# Altium project XL4005_5A.PrjPcb
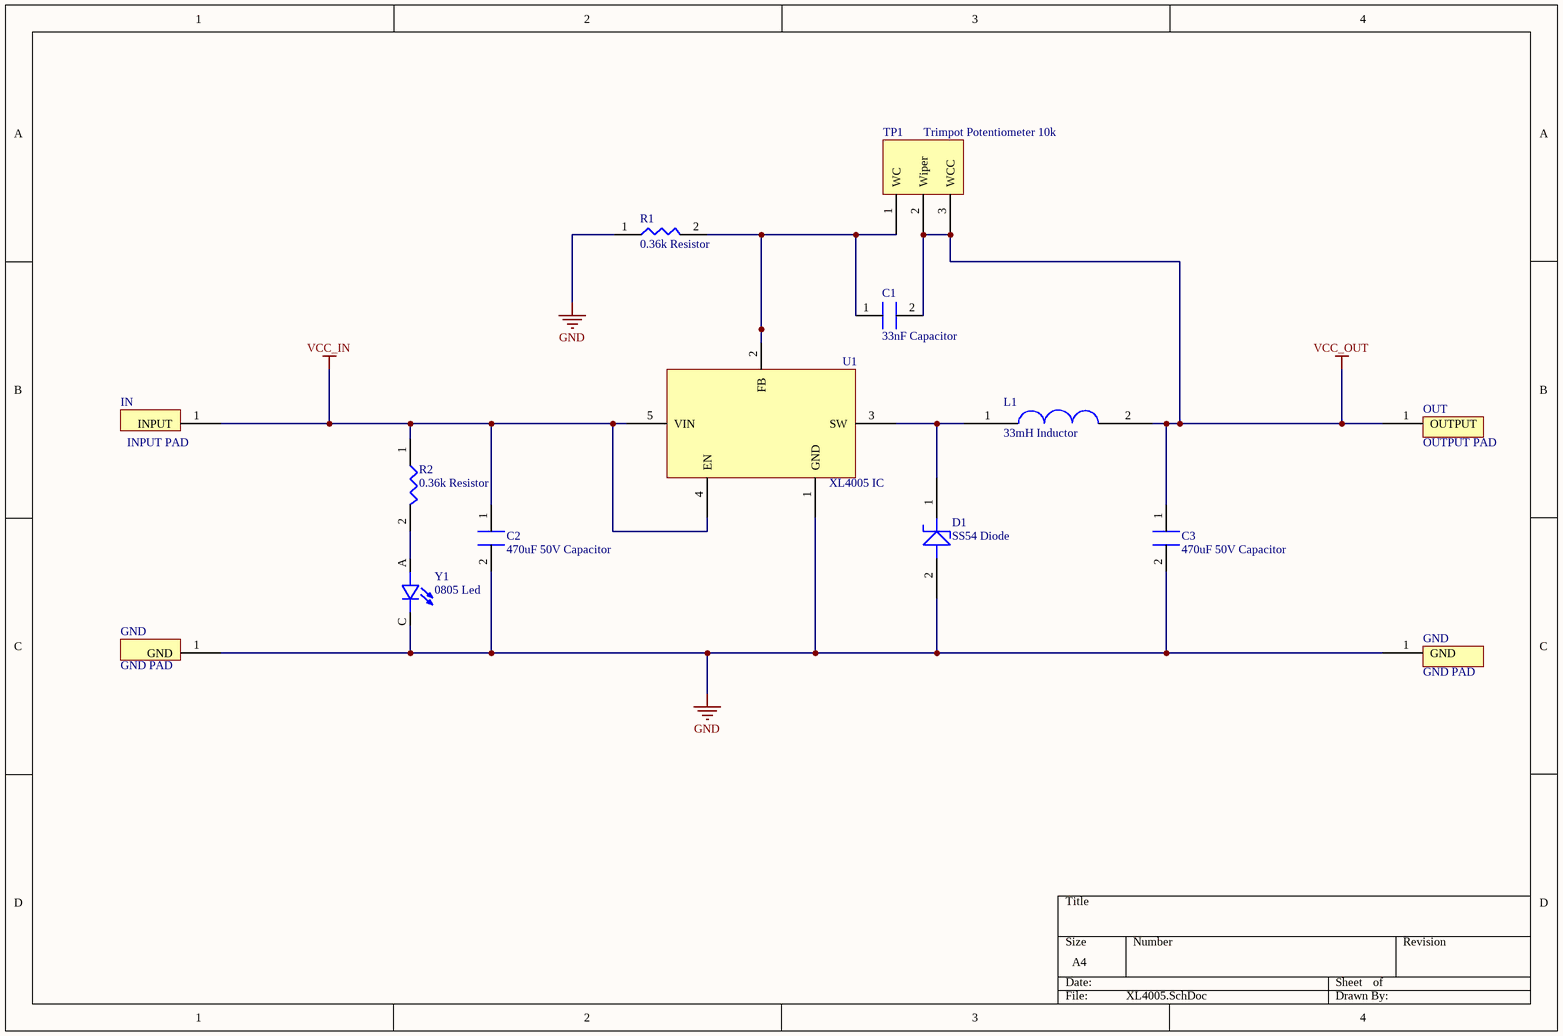
[diagram p0: XL4005.SchDoc]
1 sheet, 14 parts. Net scope: global (net labels, ports and power ports of the same name join across sheets).
Board file: 24V_Drop_Regulator.PcbDoc

## Sheet XL4005.SchDoc
size A4; SheetNumber: 1; SheetTotal: 1

### Parts
(Parts that share a designator on the sheet are numbered #1, #2 ... from top to bottom, then left to right.)
C1  33nF Capacitor  [C1206]
C2  470uF 50V Capacitor  [470uF 50V Capacitor]
C3  470uF 50V Capacitor  [470uF 50V Capacitor]
D1  SS54 Diode  [SS54]
GND#1  GND PAD  [Edge Pads]
GND#2  GND PAD  [Edge Pads]
IN  INPUT PAD  [Edge Pads]
L1  33mH Inductor  [33mH 5A Inductor SMD]
OUT  OUTPUT PAD  [Edge Pads]
R1  0.36k Resistor  [1206 Resistor]
R2  0.36k Resistor  [1206 Resistor]
TP1  Trimpot Potentiometer 10k  [Trimmer Potentiometer 3296]
U1  XL4005 IC  [XL4005]
Y1  0805 Led  [0805 Led]

### Nets
GND: C2.2 C3.2 D1.2 GND#1.1(GND) GND#2.1(GND) R1.1 U1.1(GND) Y1.C
VCC_IN: C2.1 IN.1(INPUT) R2.1 U1.4(EN) U1.5(VIN)
VCC_OUT: C1.2 C3.1 L1.2 OUT.1(OUTPUT) TP1.2(Wiper) TP1.3(WCC)
NetC1_1: C1.1(C1206_33nF) R1.2 TP1.1(WC) U1.2(FB)
NetD1_1: D1.1 L1.1 U1.3(SW)
NetR2_2: R2.2 Y1.A